# Altium schematic sheet phy1.SchDoc: SFP+ PHY 1
size A3; Date: DO NOT USE, RATHER USE PROJ OPTIONS; DrawnBy: DO NOT USE, RATHER USE PROJ OPTIONS; Engineer: DO NOT USE, RATHER USE PROJ OPTIONS; Organization: DO NOT USE, RATHER USE PROJ OPTIONS; DocumentNumber: DO NOT USE, RATHER USE PROJ OPTIONS; Revision: DO NOT USE, RATHER USE PROJ OPTIONS; SheetNumber: 3; SheetTotal: 4; SCH_Sheet_Filename: phy1.SchDoc; CurrentTime: DO NOT USE, RATHER USE PROJ OPTIONS; Time: DO NOT USE, RATHER USE PROJ OPTIONS; DocumentFullPathAndName: DO NOT USE, RATHER USE PROJ OPTIONS; DocumentName: DO NOT USE, RATHER USE PROJ OPTIONS; ModifiedDate: DO NOT USE, RATHER USE PROJ OPTIONS; ImagePath: DO NOT USE, RATHER USE PROJ OPTIONS
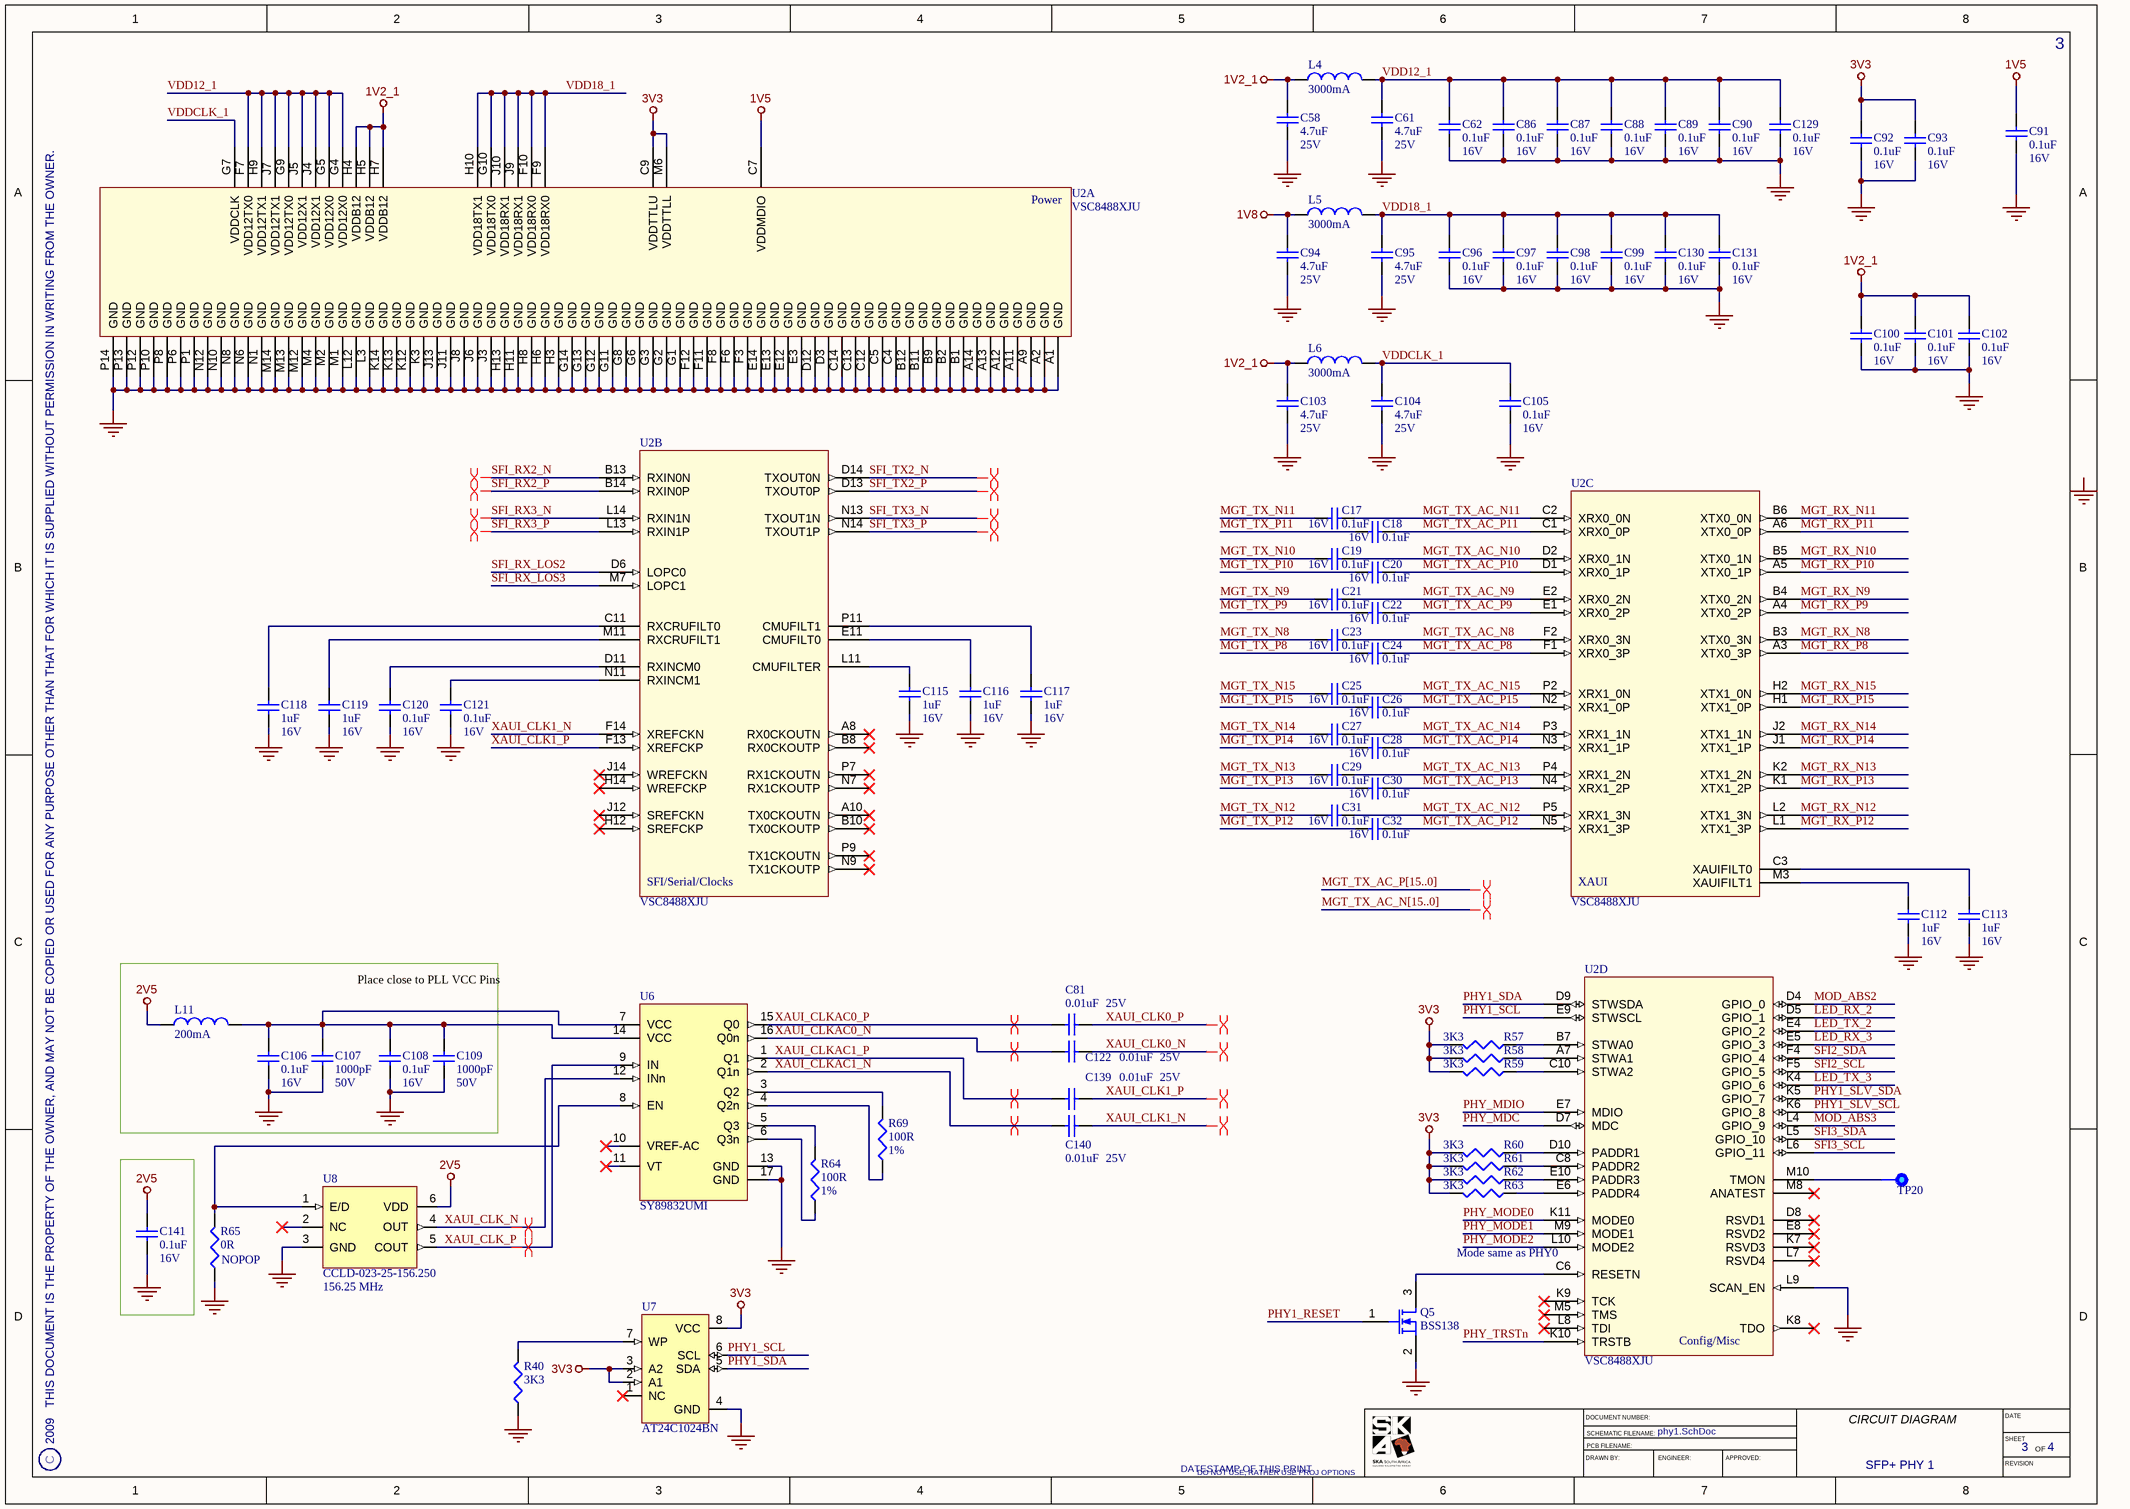
[diagram p0: phy1.SchDoc]

## Parts
C17  Rating: 16V  [CAPC1005X60L]  (hidden comment: 0.1uF)
C18  Rating: 16V  [CAPC1005X60L]  (hidden comment: 0.1uF)
C19  Rating: 16V  [CAPC1005X60L]  (hidden comment: 0.1uF)
C20  Rating: 16V  [CAPC1005X60L]  (hidden comment: 0.1uF)
C21  Rating: 16V  [CAPC1005X60L]  (hidden comment: 0.1uF)
C22  Rating: 16V  [CAPC1005X60L]  (hidden comment: 0.1uF)
C23  Rating: 16V  [CAPC1005X60L]  (hidden comment: 0.1uF)
C24  Rating: 16V  [CAPC1005X60L]  (hidden comment: 0.1uF)
C25  Rating: 16V  [CAPC1005X60L]  (hidden comment: 0.1uF)
C26  Rating: 16V  [CAPC1005X60L]  (hidden comment: 0.1uF)
C27  Rating: 16V  [CAPC1005X60L]  (hidden comment: 0.1uF)
C28  Rating: 16V  [CAPC1005X60L]  (hidden comment: 0.1uF)
C29  Rating: 16V  [CAPC1005X60L]  (hidden comment: 0.1uF)
C30  Rating: 16V  [CAPC1005X60L]  (hidden comment: 0.1uF)
C31  Rating: 16V  [CAPC1005X60L]  (hidden comment: 0.1uF)
C32  Rating: 16V  [CAPC1005X60L]  (hidden comment: 0.1uF)
C58  Rating: 25V  [CAPC2012X127L]  (hidden comment: 4.7uF)
C61  Rating: 25V  [CAPC2012X127L]  (hidden comment: 4.7uF)
C62  Rating: 16V  [CAPC1005X60L]  (hidden comment: 0.1uF)
C81  Rating: 25V  [CAPC1005X55L]  (hidden comment: 0.01uF)
C86  Rating: 16V  [CAPC1005X60L]  (hidden comment: 0.1uF)
C87  Rating: 16V  [CAPC1005X60L]  (hidden comment: 0.1uF)
C88  Rating: 16V  [CAPC1005X60L]  (hidden comment: 0.1uF)
C89  Rating: 16V  [CAPC1005X60L]  (hidden comment: 0.1uF)
C90  Rating: 16V  [CAPC1005X60L]  (hidden comment: 0.1uF)
C91  Rating: 16V  [CAPC1005X60L]  (hidden comment: 0.1uF)
C92  Rating: 16V  [CAPC1005X60L]  (hidden comment: 0.1uF)
C93  Rating: 16V  [CAPC1005X60L]  (hidden comment: 0.1uF)
C94  Rating: 25V  [CAPC2012X127L]  (hidden comment: 4.7uF)
C95  Rating: 25V  [CAPC2012X127L]  (hidden comment: 4.7uF)
C96  Rating: 16V  [CAPC1005X60L]  (hidden comment: 0.1uF)
C97  Rating: 16V  [CAPC1005X60L]  (hidden comment: 0.1uF)
C98  Rating: 16V  [CAPC1005X60L]  (hidden comment: 0.1uF)
C99  Rating: 16V  [CAPC1005X60L]  (hidden comment: 0.1uF)
C100  Rating: 16V  [CAPC1005X60L]  (hidden comment: 0.1uF)
C101  Rating: 16V  [CAPC1005X60L]  (hidden comment: 0.1uF)
C102  Rating: 16V  [CAPC1005X60L]  (hidden comment: 0.1uF)
C103  Rating: 25V  [CAPC2012X127L]  (hidden comment: 4.7uF)
C104  Rating: 25V  [CAPC2012X127L]  (hidden comment: 4.7uF)
C105  Rating: 16V  [CAPC1005X60L]  (hidden comment: 0.1uF)
C106  Rating: 16V  [CAPC1005X60L]  (hidden comment: 0.1uF)
C107  Rating: 50V  [CAPC1005X55L]  (hidden comment: 1000pF)
C108  Rating: 16V  [CAPC1005X60L]  (hidden comment: 0.1uF)
C109  Rating: 50V  [CAPC1005X55L]  (hidden comment: 1000pF)
C112  Rating: 16V  [CAPC2012X127L]  (hidden comment: 1uF)
C113  Rating: 16V  [CAPC2012X127L]  (hidden comment: 1uF)
C115  Rating: 16V  [CAPC2012X127L]  (hidden comment: 1uF)
C116  Rating: 16V  [CAPC2012X127L]  (hidden comment: 1uF)
C117  Rating: 16V  [CAPC2012X127L]  (hidden comment: 1uF)
C118  Rating: 16V  [CAPC2012X127L]  (hidden comment: 1uF)
C119  Rating: 16V  [CAPC2012X127L]  (hidden comment: 1uF)
C120  Rating: 16V  [CAPC1005X60L]  (hidden comment: 0.1uF)
C121  Rating: 16V  [CAPC1005X60L]  (hidden comment: 0.1uF)
C122  Rating: 25V  [CAPC1005X55L]  (hidden comment: 0.01uF)
C129  Rating: 16V  [CAPC1005X60L]  (hidden comment: 0.1uF)
C130  Rating: 16V  [CAPC1005X60L]  (hidden comment: 0.1uF)
C131  Rating: 16V  [CAPC1005X60L]  (hidden comment: 0.1uF)
C139  Rating: 25V  [CAPC1005X55L]  (hidden comment: 0.01uF)
C140  Rating: 25V  [CAPC1005X55L]  (hidden comment: 0.01uF)
C141  Rating: 16V  [CAPC1005X60L]  (hidden comment: 0.1uF)
L4  Rating: 3000mA  [INDC3216X130L]  (hidden comment: 120R)
L5  Rating: 3000mA  [INDC3216X130L]  (hidden comment: 120R)
L6  Rating: 3000mA  [INDC3216X130L]  (hidden comment: 120R)
L11  Rating: 200mA  [INDC2012X130L]  (hidden comment: 600R)
Q5  BSS138  [SOT95P245X110-3N]
R40  3K3  [RESC1005X40L]
R57  3K3  [RESC1005X40L]
R58  3K3  [RESC1005X40L]
R59  3K3  [RESC1005X40L]
R60  3K3  [RESC1005X40L]
R61  3K3  [RESC1005X40L]
R62  3K3  [RESC1005X40L]
R63  3K3  [RESC1005X40L]
R64  Tolerance: 1%  [RESC1005X40L]  (hidden comment: 100R)
R65  0R  [RESC1005X40L]
R69  Tolerance: 1%  [RESC1005X40L]  (hidden comment: 100R)
TP20  Testpoint  [TP100]  (value not drawn)  (no BOM)
U2  VSC8488XJU  [BGA196C100P14X14_1500x1500x140]  (parts A,B,C,D of 4)
U6  SY89832UMI  [MLF-16]
U7  AT24C1024BN  [SOIC150-8_N]
U8  Frequency: 156.25 MHz  [CCLD-023X-XX-XXX_XXX]  (hidden comment: CCLD-023-25-156.250)

## Nets
1V2_1: C58.2 C100.2 C101.2 C102.2 C103.2 L4.1 L6.1 U2.H4(VDDB12) U2.H5(VDDB12) U2.H7(VDDB12)
1V5: C91.2 U2.C7(VDDMDIO)
1V8: C94.2 L5.1
2V5: C141.2 L11.1 U8.6(VDD)
3V3: C92.2 C93.2 R57.2 R58.2 R59.2 R60.2 R61.2 R62.2 R63.2 U2.C9(VDDTTLU) U2.M6(VDDTTLL) U7.2(A1) U7.3(A2) U7.8(VCC)
GND: C58.1 C61.1 C62.1 C86.1 C87.1 C88.1 C89.1 C90.1 C91.1 C92.1 C93.1 C94.1 C95.1 C96.1 C97.1 C98.1 C99.1 C100.1 C101.1 C102.1 C104.1 C105.1 C106.1 C107.1 C108.1 C109.1 C112.2 C113.2 C115.2 C116.2 C117.2 C118.2 C119.2 C120.1 C121.1 C129.1 C130.1 C131.1 C141.1 Q5.2(S) R40.1 R65.1 U2.A1(GND) U2.A2(GND) U2.A9(GND) U2.A11(GND) U2.A12(GND) U2.A13(GND) U2.A14(GND) U2.B1(GND) U2.B2(GND) U2.B9(GND) U2.B11(GND) U2.B12(GND) U2.C4(GND) U2.C5(GND) U2.C12(GND) U2.C13(GND) U2.C14(GND) U2.D3(GND) U2.D12(GND) U2.E3(GND) U2.E12(GND) U2.E13(GND) U2.E14(GND) U2.F3(GND) U2.F6(GND) U2.F8(GND) U2.F11(GND) U2.F12(GND) U2.G1(GND) U2.G2(GND) U2.G3(GND) U2.G6(GND) U2.G8(GND) U2.G11(GND) U2.G12(GND) U2.G13(GND) U2.G14(GND) U2.H3(GND) U2.H6(GND) U2.H8(GND) U2.H11(GND) U2.H13(GND) U2.J3(GND) U2.J6(GND) U2.J8(GND) U2.J11(GND) U2.J13(GND) U2.K3(GND) U2.K12(GND) U2.K13(GND) U2.K14(GND) U2.L3(GND) U2.L9(SCAN_EN) U2.L12(GND) U2.M1(GND) U2.M2(GND) U2.M4(GND) U2.M12(GND) U2.M13(GND) U2.M14(GND) U2.N1(GND) U2.N6(GND) U2.N8(GND) U2.N10(GND) U2.N12(GND) U2.P1(GND) U2.P6(GND) U2.P8(GND) U2.P10(GND) U2.P12(GND) U2.P13(GND) U2.P14(GND) U6.13(GND) U6.17(GND) U7.4(GND) U8.3(GND)
LED_RX_2: U2.D5(GPIO_1)
LED_RX_3: U2.E5(GPIO_3)
LED_TX_2: U2.E4(GPIO_2)
LED_TX_3: U2.K4(GPIO_6)
MGT_RX_N8: U2.B3(XTX0_3N)
MGT_RX_N9: U2.B4(XTX0_2N)
MGT_RX_N10: U2.B5(XTX0_1N)
MGT_RX_N11: U2.B6(XTX0_0N)
MGT_RX_N12: U2.L2(XTX1_3N)
MGT_RX_N13: U2.K2(XTX1_2N)
MGT_RX_N14: U2.J2(XTX1_1N)
MGT_RX_N15: U2.H2(XTX1_0N)
MGT_RX_P8: U2.A3(XTX0_3P)
MGT_RX_P9: U2.A4(XTX0_2P)
MGT_RX_P10: U2.A5(XTX0_1P)
MGT_RX_P11: U2.A6(XTX0_0P)
MGT_RX_P12: U2.L1(XTX1_3P)
MGT_RX_P13: U2.K1(XTX1_2P)
MGT_RX_P14: U2.J1(XTX1_1P)
MGT_RX_P15: U2.H1(XTX1_0P)
MGT_TX_AC_N8: C23.1 U2.F2(XRX0_3N)
MGT_TX_AC_N9: C21.1 U2.E2(XRX0_2N)
MGT_TX_AC_N10: C19.1 U2.D2(XRX0_1N)
MGT_TX_AC_N11: C17.1 U2.C2(XRX0_0N)
MGT_TX_AC_N12: C31.1 U2.P5(XRX1_3N)
MGT_TX_AC_N13: C29.1 U2.P4(XRX1_2N)
MGT_TX_AC_N14: C27.1 U2.P3(XRX1_1N)
MGT_TX_AC_N15: C25.1 U2.P2(XRX1_0N)
MGT_TX_AC_P8: C24.1 U2.F1(XRX0_3P)
MGT_TX_AC_P9: C22.1 U2.E1(XRX0_2P)
MGT_TX_AC_P10: C20.1 U2.D1(XRX0_1P)
MGT_TX_AC_P11: C18.1 U2.C1(XRX0_0P)
MGT_TX_AC_P12: C32.1 U2.N5(XRX1_3P)
MGT_TX_AC_P13: C30.1 U2.N4(XRX1_2P)
MGT_TX_AC_P14: C28.1 U2.N3(XRX1_1P)
MGT_TX_AC_P15: C26.1 U2.N2(XRX1_0P)
MGT_TX_N8: C23.2
MGT_TX_N9: C21.2
MGT_TX_N10: C19.2
MGT_TX_N11: C17.2
MGT_TX_N12: C31.2
MGT_TX_N13: C29.2
MGT_TX_N14: C27.2
MGT_TX_N15: C25.2
MGT_TX_P8: C24.2
MGT_TX_P9: C22.2
MGT_TX_P10: C20.2
MGT_TX_P11: C18.2
MGT_TX_P12: C32.2
MGT_TX_P13: C30.2
MGT_TX_P14: C28.2
MGT_TX_P15: C26.2
MOD_ABS2: U2.D4(GPIO_0)
MOD_ABS3: U2.L4(GPIO_9)
PHY1_RESET: Q5.1(G)
PHY1_SCL: U2.E9(STWSCL) U7.6(SCL)
PHY1_SDA: U2.D9(STWSDA) U7.5(SDA)
PHY1_SLV_SCL: U2.K6(GPIO_8)
PHY1_SLV_SDA: U2.K5(GPIO_7)
PHY_MDC: U2.D7(MDC)
PHY_MDIO: U2.E7(MDIO)
PHY_MODE0: U2.K11(MODE0)
PHY_MODE1: U2.M9(MODE1)
PHY_MODE2: U2.L10(MODE2)
PHY_TRSTn: U2.K10(TRSTB)
SFI2_SCL: U2.F5(GPIO_5)
SFI2_SDA: U2.F4(GPIO_4)
SFI3_SCL: U2.L6(GPIO_11)
SFI3_SDA: U2.L5(GPIO_10)
SFI_RX2_N: U2.B13(RXIN0N)
SFI_RX2_P: U2.B14(RXIN0P)
SFI_RX3_N: U2.L14(RXIN1N)
SFI_RX3_P: U2.L13(RXIN1P)
SFI_RX_LOS2: U2.D6(LOPC0)
SFI_RX_LOS3: U2.M7(LOPC1)
SFI_TX2_N: U2.D14(TXOUT0N)
SFI_TX2_P: U2.D13(TXOUT0P)
SFI_TX3_N: U2.N13(TXOUT1N)
SFI_TX3_P: U2.N14(TXOUT1P)
VDD12_1: C61.2 C62.2 C86.2 C87.2 C88.2 C89.2 C90.2 C129.2 L4.2 U2.F7(VDD12TX0) U2.G4(VDD12X0) U2.G5(VDD12X0) U2.G9(VDD12TX0) U2.H9(VDD12TX1) U2.J4(VDD12X1) U2.J5(VDD12X1) U2.J7(VDD12TX1)
VDD18_1: C95.2 C96.2 C97.2 C98.2 C99.2 C130.2 C131.2 L5.2 U2.F9(VDD18RX0) U2.F10(VDD18RX0) U2.G10(VDD18TX0) U2.H10(VDD18TX1) U2.J9(VDD18RX1) U2.J10(VDD18RX1)
VDDCLK_1: C104.2 C105.2 L6.2 U2.G7(VDDCLK)
XAUI_CLK0_N: C122.2
XAUI_CLK0_P: C81.2
XAUI_CLK1_N: C140.2 U2.F14(XREFCKN)
XAUI_CLK1_P: C139.2 U2.F13(XREFCKP)
XAUI_CLK_N: U6.12(INn) U8.4(OUT)
XAUI_CLK_P: U6.9(IN) U8.5(COUT)
XAUI_CLKAC0_N: C122.1 U6.16(Q0n)
XAUI_CLKAC0_P: C81.1 U6.15(Q0)
XAUI_CLKAC1_N: C140.1 U6.2(Q1n)
XAUI_CLKAC1_P: C139.1 U6.1(Q1)
NetC106_2: C106.2 C107.2 C108.2 C109.2 L11.2 U6.7(VCC) U6.14(VCC)
NetC112_1: C112.1 U2.M3(XAUIFILT1)
NetC113_1: C113.1 U2.C3(XAUIFILT0)
NetC115_1: C115.1 U2.L11(CMUFILTER)
NetC116_1: C116.1 U2.E11(CMUFILT0)
NetC117_1: C117.1 U2.P11(CMUFILT1)
NetC118_1: C118.1 U2.C11(RXCRUFILT0)
NetC119_1: C119.1 U2.M11(RXCRUFILT1)
NetC120_2: C120.2 U2.D11(RXINCM0)
NetC121_2: C121.2 U2.N11(RXINCM1)
NetQ5_3: Q5.3(D) U2.C6(RESETN)
NetR40_2: R40.2 U7.7(WP)
NetR57_1: R57.1 U2.B7(STWA0)
NetR58_1: R58.1 U2.A7(STWA1)
NetR59_1: R59.1 U2.C10(STWA2)
NetR60_1: R60.1 U2.D10(PADDR1)
NetR61_1: R61.1 U2.C8(PADDR2)
NetR62_1: R62.1 U2.E10(PADDR3)
NetR63_1: R63.1 U2.E6(PADDR4)
NetR64_1: R64.1 U6.6(Q3n)
NetR64_2: R64.2 U6.5(Q3)
NetR65_2: R65.2 U6.8(EN) U8.1(E/D)
NetR69_1: R69.1 U6.4(Q2n)
NetR69_2: R69.2 U6.3(Q2)
NetTP20_1: TP20.1 U2.M10(TMON)

Not connected (* = marked no-connect by the designer): C103 1; U2 A8(RX0CKOUTN)* A10(TX0CKOUTN)* B8(RX0CKOUTP)* B10(TX0CKOUTP)* D8(RSVD1)* E8(RSVD2)* H12(SREFCKP)* H14(WREFCKP)* J12(SREFCKN)* J14(WREFCKN)* K7(RSVD3)* K8(TDO)* K9(TCK)* L7(RSVD4)* L8(TDI)* M5(TMS)* M8(ANATEST)* N7(RX1CKOUTP)* N9(TX1CKOUTP)* P7(RX1CKOUTN)* P9(TX1CKOUTN)*; U6 10(VREF-AC)* 11(VT)*; U7 1(NC)*; U8 2(NC)*

## Buses and harness runs
bus MGT_TX_AC_N[15..0]
bus MGT_TX_AC_P[15..0]

## Layout directives
differential pair: (no net found under the mark), SFI_RX2_N, SFI_RX2_P, SFI_RX3_N, SFI_RX3_P, SFI_TX2_N, SFI_TX2_P, SFI_TX3_N, SFI_TX3_P, XAUI_CLK0_N, XAUI_CLK0_P, XAUI_CLK1_N, XAUI_CLK1_P, XAUI_CLK_N, XAUI_CLK_P, XAUI_CLKAC0_N, XAUI_CLKAC0_P, XAUI_CLKAC1_N, XAUI_CLKAC1_P

## Notes on the sheet
- Place close to PLL VCC Pins
- (near R65) NOPOP
- (near U2) Mode same as PHY0
- Labels drawn without touching a wire or pin: GND
- 2009   THIS DOCUMENT IS THE PROPERTY OF THE OWNER, AND MAY NOT BE COPIED OR USED FOR ANY PURPOSE OTHER THAN THAT FOR WHICH IT IS SUPPLIED WITHOUT PERMISSION IN WRITING FROM THE OWNER.
- C
- DATESTAMP OF THIS PRINT
- DRAWN BY:
- DOCUMENT NUMBER:
- SCHEMATIC FILENAME:
- PCB FILENAME:
- ENGINEER:
- APPROVED:
- CIRCUIT DIAGRAM
- DATE
- SHEET
- REVISION
- OF
- (in symbol IC-PHY-2, part A) Power
- (in symbol IC-PHY-2, part B) SFI/Serial/Clocks
- (in symbol IC-PHY-2, part C) XAUI
- (in symbol IC-PHY-2, part D) Config/Misc

## Library data of the parts
C17-C32 C62 C86-C93 C96-C102 C105 C106 C108 C120 C121 C129-C131 C141 = CAP-CER-1: 0.1uF, Ceramic Capacitor; Manufacturer: VENKEL; PartNum: C0402X7R160-104KN; Tolerance: 10%; Dielectric: X7R; POD number: CAP-CER-1; Value: 0.1uF; RoHS: Y; Sort Value: 0.1; Category: Capacitors; Subcategory: Ceramic
C58 C61 C94 C95 C103 C104 = CAP-CER-3: 4.7uF, Ceramic Capacitor; Manufacturer: MURATA; PartNum: GRM21BR61E475KA12K; Tolerance: 10%; Dielectric: X5R; POD number: CAP-CER-3; Value: 4.7uF; RoHS: Y; Sort Value: 4.7; Category: Capacitors; Subcategory: Ceramic
C81 C122 C139 C140 = CAP-CER-6: 0.01uF, Ceramic Capacitor; Manufacturer: MURATA; PartNum: GRM155R71E103KA01D; Tolerance: 10%; Dielectric: X7R; POD number: CAP-CER-6; Value: 0.01uF; RoHS: Y; Sort Value: 0.01; Category: Capacitors; Subcategory: Ceramic
C107 C109 = CAP-CER-4: 1000pF, Ceramic Capacitor; Manufacturer: MURATA; PartNum: GRM155R61H102KA01D; Tolerance: 10%; Dielectric: X5R; POD number: CAP-CER-4; Value: 1000pF; RoHS: Y; Sort Value: 0.0001; Category: Capacitors; Subcategory: Ceramic
C112 C113 C115-C119 = CAP-CER-8: 1uF, Ceramic Capacitor; Manufacturer: MURATA; PartNum: GRM21BR61C105KA01L; Tolerance: 10%; Dielectric: X5R; POD number: CAP-CER-8; Value: 1uF; RoHS: Y; Sort Value: 100; Category: Capacitors; Subcategory: Ceramic
L4-L6 = IND-FB-1: 120 Ohm, Chip Ferrite Brad; Manufacturer: Murata; PartNum: BLM31PG121SN1; DC Res: 0.025R; Tolerance: 25%; POD number: IND-FB-1; RoHS: Y; Value: 120R; Sort Value: 120; Category: Inductors; Subcategory: FerriteBead
L11 = IND-FB-0: 600 Ohm, Chip Ferrite Bead; Manufacturer: Murata; PartNum: BLM21BD601SN1; DC Res: 0.35R; Tolerance: 25%; POD number: IND-FB-0; RoHS: Y; Value: 600R; Sort Value: 600; Category: Inductors; Subcategory: FerriteBead
Q5 = TRANS-NFET-0: N-Channel Logic Level Enhancement Mode Field Effect Transistor; Manufacturer: Fairchild Semiconductor; Rating: 0.22A; POD number: TRANS-NFET-0; PartNum: BSS138; RoHS: Y; Category: TRANS; Subcategory: NFET
R40 R57-R63 = RES-TF-7: 3K3, 1.1mm x 0.5mm, Thick Film Resistor; Manufacturer: ROYALOHM; PartNum: 0402WGJ0332T1E; Tolerance: 5%; Rating: 0.0625W; POD number: RES-TF-7; Value: 3K3; Sort Value: 3300; Category: Resistors; Subcategory: ThickFilm; HelpURL: http://www.royalohm.com/pdf/general.pdf
R64 R69 = RES-TF-14: 100R, 1.1mm x 0.5mm, Thick Film Resistor; Manufacturer: ROYALOHM; PartNum: 0402WGF0101T1E; Rating: 0.0625W; POD number: RES-TF-14; Value: 100R; Sort Value: 1000; Category: Resistors; Subcategory: ThickFilm; HelpURL: *.pdf
R65 = RES-TF-0: 0R, 1.1mm x 0.5mm, Thick Film Resistor; Manufacturer: ROYALOHM; PartNum: 0402WG00000T1E; Tolerance: 0%; Rating: 0.0625W; POD number: RES-TF-0; Value: 0R; Sort Value: 0; Category: Resistors; Subcategory: ThickFilm; HelpURL: *.pdf
TP20 = ELMECH-TP-0: 1mm Diameter, through-hole, Circular Test-point; POD number: ELMECH-TP-0; RoHS: Y; Category: ELMECH; Subcategory: Test Points
U2 = IC-PHY-2: DualChannel WAN/LAN/Backplane XAUI to SFP+/KR Transceiver; Manufacturer: Vitesse; POD number: IC-PHY-2; PartNum: VSC8488XJU; RoHS: Y; Category: IC; Subcategory: Network PHY
U6 = IC-LOG-14: 2.5 C Ultra-precision 1:4 LVDS Fanout Buffer/Translator with Interal Termination; Manufacturer: Micrel; POD number: IC-LOG-14; PartNum: SY89832UMI; RoHS: Y; Category: IC; Subcategory: Logic
U7 = IC-MEM-5: 1M, SOIC-8, Serial EEPROM; Manufacturer: Atmel; PartNum: AT24C1024BN-SH-B; POD number: IC-MEM-5; RoHS: Y; Category: IC; Subcategory: Memory
U8 = RESN-CLK-4: 156.25 MHz, Low-Jitter Differential LVDS Clock Oscillator; Manufacturer: Crystek; Stability: 25 PPM; POD number: RESN-CLK-4; PartNum: CCLD-023-25-156.250; RoHS: Y; Category: RESN; Subcategory: Clock Oscillators